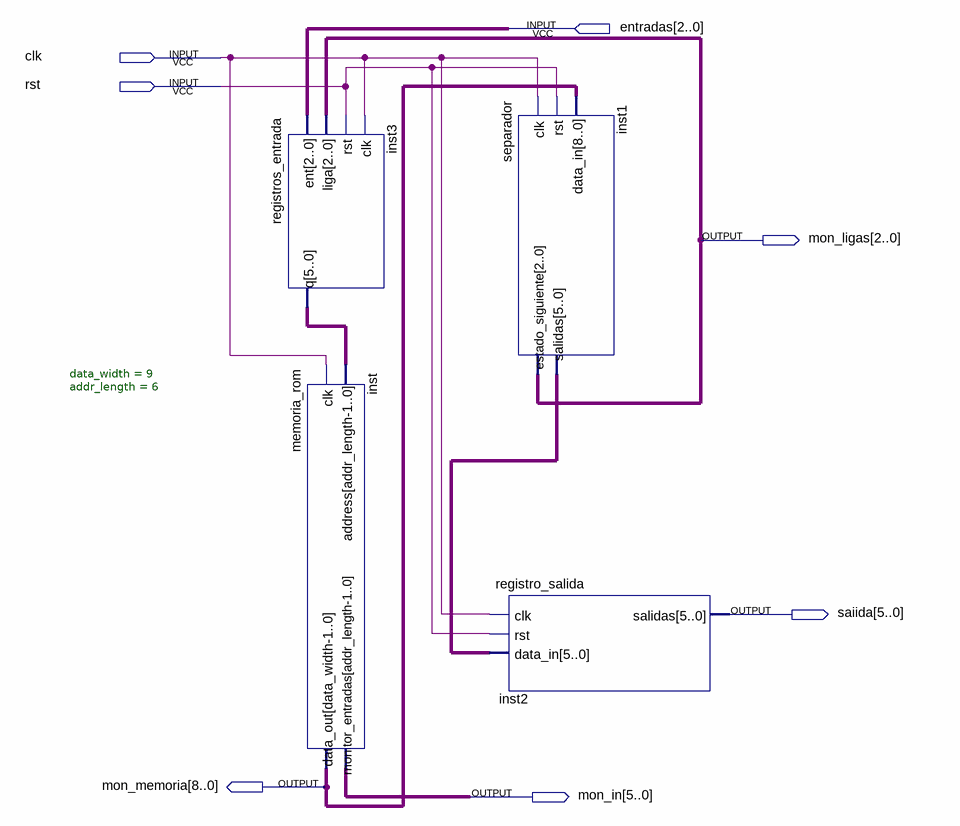
[diagram p0: schematic sheet]
// Quartus schematic practica_3.bdf as structural Verilog: 4 symbols, 7 pins
module practica_3 (
  input  [2:0] entradas,
  input  clk,
  input  rst,
  output [2:0] mon_ligas,
  output [5:0] saiida,
  output [8:0] mon_memoria,
  output [5:0] mon_in
);

  wire [5:0] inst1_salidas, inst3_q;

  registros_entrada inst3 (.ent(entradas), .liga(mon_ligas), .rst(rst), .clk(clk), .q(inst3_q));
  memoria_rom #(.data_width(9), .addr_length(6)) inst (
    .clk(clk), .address(inst3_q), .data_out(mon_memoria), .monitor_entradas(mon_in));
  separador inst1 (.clk(clk), .rst(rst), .data_in(mon_memoria), .estado_siguiente(mon_ligas), .salidas(inst1_salidas));
  registro_salida inst2 (.clk(clk), .rst(rst), .data_in(inst1_salidas), .salidas(saiida));
endmodule
